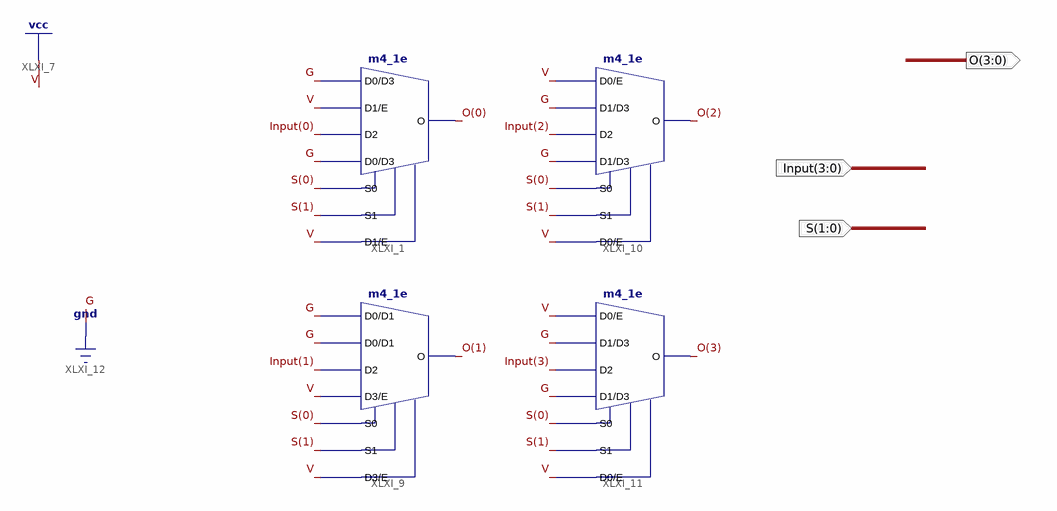
[diagram p0: schematic sheet 1]
// Xilinx ISE schematic mux3input4bit.sch (spartan3adsp) as structural Verilog: 4 symbols, 3 ports
module mux3input4bit (
  input  [3:0] Input,
  input  [1:0] S,
  output [3:0] O
);

  m4_1e XLXI_1 (.D0(1'b0), .D1(1'b1), .D2(Input[0]), .D3(1'b0), .E(1'b1), .S0(S[0]), .S1(S[1]), .O(O[0]));
  m4_1e XLXI_9 (.D0(1'b0), .D1(1'b0), .D2(Input[1]), .D3(1'b1), .E(1'b1), .S0(S[0]), .S1(S[1]), .O(O[1]));
  m4_1e XLXI_10 (.D0(1'b1), .D1(1'b0), .D2(Input[2]), .D3(1'b0), .E(1'b1), .S0(S[0]), .S1(S[1]), .O(O[2]));
  m4_1e XLXI_11 (.D0(1'b1), .D1(1'b0), .D2(Input[3]), .D3(1'b0), .E(1'b1), .S0(S[0]), .S1(S[1]), .O(O[3]));
endmodule
